# EAGLE design eTapper1main37 (EAGLE 8.4.0)
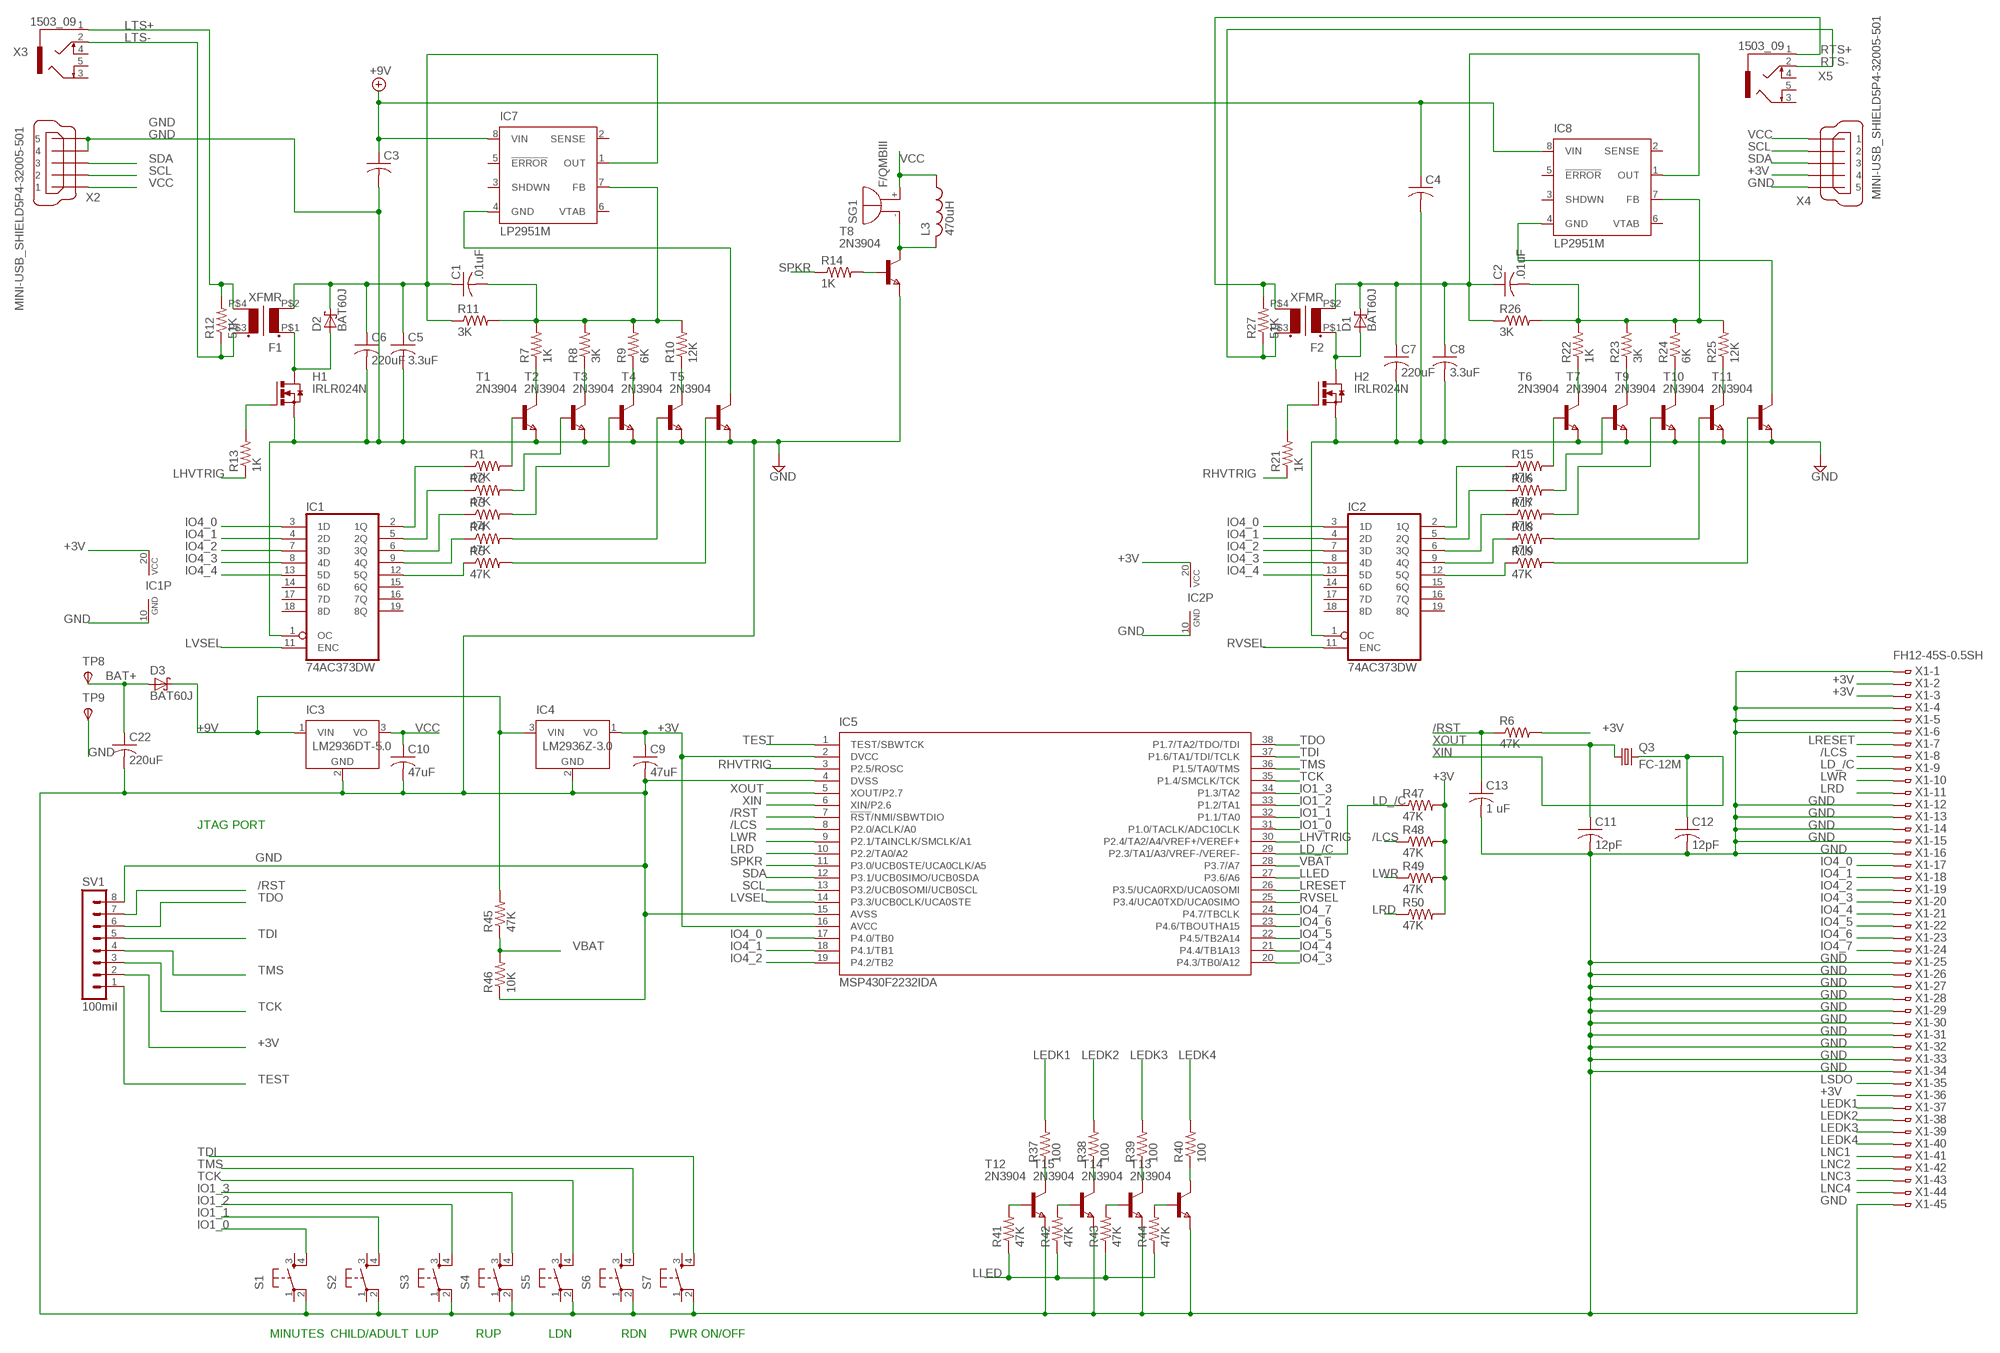
[diagram p0: schematic, sheet 1]

## Parts
C1  .01uF  C-USC0805  [C0805]
C2  .01uF  C-USC0805  [C0805]
C3  C-USC1206  [C1206]
C4  C-USC1206  [C1206]
C5  3.3uF  C-USC0805  [C0805]
C6  220uF  C-USC1206  [C1206]
C7  220uF  C-USC1206  [C1206]
C8  3.3uF  C-USC0805  [C0805]
C9  47uF  C-USC1206  [C1206]
C10  47uF  C-USC1206  [C1206]
C11  12pF  C-USC0805  [C0805]
C12  12pF  C-USC0805  [C0805]
C13  1 uF  C-USC0805  [C0805]
C22  220uF  C-USC1206  [C1206]
D1  BAT60J  [SOD323_ST]
D2  BAT60J  [SOD323_ST]
D3  BAT60J  [SOD323_ST]
F1  XFMR  [XFMR]
F2  XFMR  [XFMR]
H1  IRLR024N  [D-PAK_TO252AA]
H2  IRLR024N  [D-PAK_TO252AA]
IC1  74AC373DW  [SO20W]
IC2  74AC373DW  [SO20W]
IC3  LM2936DT-5.0  [TO252]
IC4  LM2936Z-3.0  [TO92]
IC5  MSP430F2232IDA  [TSSOP38_R-PDSO-G38-DA]
IC7  LP2951M  [SO08]
IC8  LP2951M  [SO08]
L3  470uH  L-USL2825P  [L2825P]
Q3  FC-12M  [FC-12M]
R1  47K  R-US_R0402  [R0402]
R2  47K  R-US_R0402  [R0402]
R3  47K  R-US_R0402  [R0402]
R4  47K  R-US_R0402  [R0402]
R5  47K  R-US_R0402  [R0402]
R6  47K  R-US_R0402  [R0402]
R7  1K  R-US_R0402  [R0402]
R8  3K  R-US_R0402  [R0402]
R9  6K  R-US_R0402  [R0402]
R10  12K  R-US_R0402  [R0402]
R11  3K  R-US_R0402  [R0402]
R12  51K  R-US_R0402  [R0402]
R13  1K  R-US_R0402  [R0402]
R14  1K  R-US_R0402  [R0402]
R15  47K  R-US_R0402  [R0402]
R16  47K  R-US_R0402  [R0402]
R17  47K  R-US_R0402  [R0402]
R18  47K  R-US_R0402  [R0402]
R19  47K  R-US_R0402  [R0402]
R21  1K  R-US_R0402  [R0402]
R22  1K  R-US_R0402  [R0402]
R23  3K  R-US_R0402  [R0402]
R24  6K  R-US_R0402  [R0402]
R25  12K  R-US_R0402  [R0402]
R26  3K  R-US_R0402  [R0402]
R27  51K  R-US_R0402  [R0402]
R37  100  R-US_R0402  [R0402]
R38  100  R-US_R0402  [R0402]
R39  100  R-US_R0402  [R0402]
R40  100  R-US_R0402  [R0402]
R41  47K  R-US_R0402  [R0402]
R42  47K  R-US_R0402  [R0402]
R43  47K  R-US_R0402  [R0402]
R44  47K  R-US_R0402  [R0402]
R45  47K  R-US_R0402  [R0402]
R46  10K  R-US_R0402  [R0402]
R47  47K  R-US_R0402  [R0402]
R48  47K  R-US_R0402  [R0402]
R49  47K  R-US_R0402  [R0402]
R50  47K  R-US_R0402  [R0402]
S1  10-XX  [B3F-10XX]
S2  10-XX  [B3F-10XX]
S3  10-XX  [B3F-10XX]
S4  10-XX  [B3F-10XX]
S5  10-XX  [B3F-10XX]
S6  10-XX  [B3F-10XX]
S7  10-XX  [B3F-10XX]
SG1  F/QMBIII  [F/QMBIII]
SV1  100mil  MA08-1  [MA08-1]
T1  2N3904  NPNSOT23  [SOT-23]
T2  2N3904  NPNSOT23  [SOT-23]
T3  2N3904  NPNSOT23  [SOT-23]
T4  2N3904  NPNSOT23  [SOT-23]
T5  2N3904  NPNSOT23  [SOT-23]
T6  2N3904  NPNSOT23  [SOT-23]
T7  2N3904  NPNSOT23  [SOT-23]
T8  2N3904  NPNSOT23  [SOT-23]
T9  2N3904  NPNSOT23  [SOT-23]
T10  2N3904  NPNSOT23  [SOT-23]
T11  2N3904  NPNSOT23  [SOT-23]
T12  2N3904  NPNSOT23  [SOT-23]
T13  2N3904  NPNSOT23  [SOT-23]
T14  2N3904  NPNSOT23  [SOT-23]
T15  2N3904  NPNSOT23  [SOT-23]
TP8  TPSTP06R  [TP06R]
TP9  TPSTP06R  [TP06R]
X1  FH12-45S-0.5SH  [FH12-45S-0.5SH]
X2  MINI-USB_SHIELD5P4-32005-501  [32005-501]
X3  1503_09  [1503_09]
X4  MINI-USB_SHIELD5P4-32005-501  [32005-501]
X5  1503_09  [1503_09]

## Nets
+3V [+3V]: C9.1 IC1.20(VCC) IC2.20(VCC) IC4.1(VO) IC5.2(DVCC) IC5.16(AVCC) R6.2 R47.2 R48.2 R49.2 R50.2 SV1.2 X1.2 X1.3 X1.36 X4.4
+9V [+9V]: C3.1 C4.1 D3.C IC3.1(VIN) IC4.3(VIN) IC7.8(VIN) IC8.8(VIN) R45.2
/LCS: IC5.8(P2.0/ACLK/A0) R48.1 X1.8
/RST: C13.1 IC5.7(!RST!/NMI/SBWTDIO) R6.1 SV1.7
BAT+ [BAT+]: C22.1 D3.A TP8.TP(PP)
GND [GND]: C3.2 C4.2 C5.2 C6.2 C7.2 C8.2 C9.2 C10.2 C11.2 C12.2 C13.2 C22.2 H1.3(S) H2.3(S) IC1.1(OC) IC1.10(GND) IC2.1(OC) IC2.10(GND) IC3.2(GND) IC4.2(GND) IC5.4(DVSS) IC5.15(AVSS) R46.1 S1.2(P1) S2.2(P1) S3.2(P1) S4.2(P1) S5.2(P1) S6.2(P1) S7.2(P1) SV1.8 T1.2(E) T2.2(E) T3.2(E) T4.2(E) T5.2(E) T6.2(E) T7.2(E) T8.2(E) T9.2(E) T10.2(E) T11.2(E) T12.2(E) T13.2(E) T14.2(E) T15.2(E) TP9.TP(PP) X1.1 X1.4 X1.5 X1.6 X1.12 X1.13 X1.14 X1.15 X1.16 X1.25 X1.26 X1.27 X1.28 X1.29 X1.30 X1.31 X1.32 X1.33 X1.34 X1.45 X2.4 X2.5 X4.5
IO1_0: IC5.31(P1.0/TACLK/ADC10CLK) S1.4(S1)
IO1_1: IC5.32(P1.1/TA0) S2.4(S1)
IO1_2: IC5.33(P1.2/TA1) S3.4(S1)
IO1_3: IC5.34(P1.3/TA2) S4.4(S1)
IO4_0: IC1.3(1D) IC2.3(1D) IC5.17(P4.0/TB0) X1.17
IO4_1: IC1.4(2D) IC2.4(2D) IC5.18(P4.1/TB1) X1.18
IO4_2: IC1.7(3D) IC2.7(3D) IC5.19(P4.2/TB2) X1.19
IO4_3: IC1.8(4D) IC2.8(4D) IC5.20(P4.3/TB0/A12) X1.20
IO4_4: IC1.13(5D) IC2.13(5D) IC5.21(P4.4/TB1A13) X1.21
IO4_5: IC5.22(P4.5/TB2A14) X1.22
IO4_6: IC5.23(P4.6/TBOUTHA15) X1.23
IO4_7: IC5.24(P4.7/TBCLK) X1.24
LD_/C: IC5.29(P2.3/TA1/A3/VREF-/VEREF-) R47.1 X1.9
LEDK1: R37.2 X1.37
LEDK2: R38.2 X1.38
LEDK3: R39.2 X1.39
LEDK4: R40.2 X1.40
LHVTRIG: IC5.30(P2.4/TA2/A4/VREF+/VEREF+) R13.1
LLED: IC5.27(P3.6/A6) R41.1 R42.1 R43.1 R44.1
LNC1: X1.41
LNC2: X1.42
LNC3: X1.43
LNC4: X1.44
LRD: IC5.10(P2.2/TA0/A2) R50.1 X1.11
LRESET: IC5.26(P3.5/UCA0RXD/UCA0SOMI) X1.7
LSDO: X1.35
LTS+: F1.P$4(S2) R12.2 X3.1
LTS-: F1.P$3(S1) R12.1 X3.2
LVSEL: IC1.11(ENC) IC5.14(P3.3/UCB0CLK/UCA0STE)
LWR: IC5.9(P2.1/TAINCLK/SMCLK/A1) R49.1 X1.10
N$1: IC1.2(1Q) R1.1
N$2: IC1.5(2Q) R2.1
N$3: IC1.6(3Q) R3.1
N$4: IC1.9(4Q) R4.1
N$5: IC1.12(5Q) R5.1
N$6: L3.2 SG1.-(+) T8.1(C)
N$7: R4.2 T4.3(B)
N$8: R5.2 T5.3(B)
N$9: D2.A F1.P$1(P1) H1.4(D)
N$10: R7.1 T1.1(C)
N$11: R8.1 T2.1(C)
N$12: R9.1 T3.1(C)
N$13: R1.2 T1.3(B)
N$14: R2.2 T2.3(B)
N$15: R3.2 T3.3(B)
N$16: R10.1 T4.1(C)
N$17: C1.2 IC7.7(FB) R7.2 R8.2 R9.2 R10.2 R11.2
N$18: C1.1 C5.1 C6.1 D2.C F1.P$2(P2) IC7.1(OUT) R11.1
N$19: D1.A F2.P$1(P1) H2.4(D)
N$20: IC2.2(1Q) R15.1
N$21: H1.1(G) R13.2
N$22: R14.2 T8.3(B)
N$24: IC2.5(2Q) R16.1
N$25: IC2.6(3Q) R17.1
N$26: IC2.9(4Q) R18.1
N$27: IC2.12(5Q) R19.1
N$28: R44.2 T13.3(B)
N$29: R15.2 T6.3(B)
N$30: R16.2 T7.3(B)
N$31: R17.2 T9.3(B)
N$32: R18.2 T10.3(B)
N$33: R19.2 T11.3(B)
N$35: R22.1 T6.1(C)
N$36: R23.1 T7.1(C)
N$37: R24.1 T9.1(C)
N$38: R25.1 T10.1(C)
N$39: C2.2 IC8.7(FB) R22.2 R23.2 R24.2 R25.2 R26.2
N$40: C2.1 C7.1 C8.1 D1.C F2.P$2(P2) IC8.1(OUT) R26.1
N$41: R37.1 T12.1(C)
N$42: H2.1(G) R21.2
N$43: R38.1 T15.1(C)
N$44: R39.1 T14.1(C)
N$45: IC7.4(GND) T5.1(C)
N$46: R40.1 T13.1(C)
N$47: IC8.4(GND) T11.1(C)
N$48: R43.2 T14.3(B)
N$49: R41.2 T12.3(B)
N$50: R42.2 T15.3(B)
RHVTRIG: IC5.3(P2.5/ROSC) R21.1
RTS+: F2.P$4(S2) R27.2 X5.1
RTS-: F2.P$3(S1) R27.1 X5.2
RVSEL: IC2.11(ENC) IC5.25(P3.4/UCA0TXD/UCA0SIMO)
SCL: IC5.13(P3.2/UCB0SOMI/UCB0SCL) X2.2 X4.2
SDA: IC5.12(P3.1/UCB0SIMO/UCB0SDA) X2.3 X4.3
SPKR: IC5.11(P3.0/UCB0STE/UCA0CLK/A5) R14.1
TCK: IC5.35(P1.4/SMCLK/TCK) S5.4(S1) SV1.3
TDI: IC5.37(P1.6/TA1/TDI/TCLK) S7.4(S1) SV1.5
TDO: IC5.38(P1.7/TA2/TDO/TDI) SV1.6
TEST: IC5.1(TEST/SBWTCK) SV1.1
TMS: IC5.36(P1.5/TA0/TMS) S6.4(S1) SV1.4
VBAT: IC5.28(P3.7/A7) R45.1 R46.2
VCC [VCC]: C10.1 IC3.3(VO) L3.1 SG1.+(-) X2.1 X4.1
XIN: C12.1 IC5.6(XIN/P2.6) Q3.2
XOUT: C11.1 IC5.5(XOUT/P2.7) Q3.1
Unconnected: IC1.14(6D) IC1.15(6Q) IC1.16(7Q) IC1.17(7D) IC1.18(8D) IC1.19(8Q) IC2.14(6D) IC2.15(6Q) IC2.16(7Q) IC2.17(7D) IC2.18(8D) IC2.19(8Q) IC7.2(SENSE) IC7.3(SHDWN) IC7.5(!ERROR) IC7.6(VTAB) IC8.2(SENSE) IC8.3(SHDWN) IC8.5(!ERROR) IC8.6(VTAB) S1.1(P) S1.3(S) S2.1(P) S2.3(S) S3.1(P) S3.3(S) S4.1(P) S4.3(S) S5.1(P) S5.3(S) S6.1(P) S6.3(S) S7.1(P) S7.3(S) X2.M1(S1) X2.M2(S2) X2.M3(S3) X2.M4(S4) X3.3 X3.4 X3.5 X4.M1(S1) X4.M2(S2) X4.M3(S3) X4.M4(S4) X5.3 X5.4 X5.5

## Notes on the sheet
- JTAG PORT
- MINUTES | CHILD/ADULT | LUP | RUP | LDN | RDN | PWR ON/OFF

## Library data of the parts
C1-C13 C22 = rcl:C-US: CAPACITOR, American symbol
D1-D3 = diode:BAT60J: Schottky barrier diode Source: www.st.com, BAT60J.pdf
F1 F2 = XFMR1:XFMR: Transformer 1"X1" 0.4"X0.4" hole separation for e_tapper
H1 H2 = IRLR024N:IRLR024N: IRLR024N HEXFET Power Mosfet N channel Infeneon Technology TO-251AA IPAK
IC1 IC2 = 74xx-eu:74*373: Octal D type transparent LATCH, edge triggered
IC3 = national-semiconductor:LM2936?*: Ultra-Low Quiescent Current LDO Voltage Regulator Source: Data sheet <http://www.national.com/ds/LM/LM2936.pdf>; MF: NATIONAL SEMICONDUCTOR; MPN: LM2936DT-5.0/NOPB; OC_FARNELL: 1286864; OC_NEWARK: 41K4501
IC4 = national-semiconductor:LM2936?*: Ultra-Low Quiescent Current LDO Voltage Regulator Source: Data sheet <http://www.national.com/ds/LM/LM2936.pdf>; MF: NATIONAL SEMICONDUCTOR; MPN: LM2936Z-3.0/NOPB; OC_FARNELL: 1312709; OC_NEWARK: 41K4531
IC5 = texas:MSP430F22*2IDA: MIXED SIGNAL MICROCONTROLLER Source: http://focus.ti.com/lit/ds/symlink/msp430f2274.pdf; MPN: MSP430F2232IDA; OC_FARNELL: 1610178; OC_NEWARK: 28M6312
IC7 IC8 = national-semiconductor:LP2951: Adjustable Micropower Voltage Regulator Source: http://www.national.com/ds/LP/LP2950.pdf; MF: FAIRCHILD SEMICONDUCTOR; MPN: LP2951CM; OC_FARNELL: 9488561; OC_NEWARK: 78K6014
L3 = rcl:L-US: INDUCTOR, American symbol
Q3 = crystal:FC-12M: kHz RANGE CRYSTAL UNIT LOW PROFILE SMD Source: Epson Toyocom FC-12M.pdf
R1-R19 R21-R27 R37-R50 = resistor:R-US_: RESISTOR, American symbol
S1-S7 = switch-omron:10-XX: OMRON SWITCH; MPN: B3F-1000; OC_FARNELL: 176432; OC_NEWARK: 36M3542
SG1 = buzzer:F/QMBIII: BUZZER Source: Buerklin; OC_FARNELL: unknown; OC_NEWARK: unknown
SV1 = con-lstb:MA08-1: PIN HEADER; OC_FARNELL: unknown; OC_NEWARK: unknown
T1-T15 = zetex:NPNSOT23: NPN TRANSISTOR; MPN: DSS20201L-7; OC_FARNELL: 1710688; OC_NEWARK: 25R4555
TP8 TP9 = testpad:TPS: TEST PIN
X1 = con-hirose:FH12-45S-0.5S: 0.5mm Pitch Connectors For FPC/FFC Source: Data sheet <http://www.hirose.co.jp/cataloge_hp/e58605370.pdf>; OC_FARNELL: unknown; OC_NEWARK: unknown
X2 X4 = con-cypressindustries:MINI-USB_SHIELD5P4-: MINI USB-B R/A W/O POST 5 pol. Source: www.cypressindustries.com; OC_FARNELL: unknown; OC_NEWARK: unknown
X3 X5 = con-lumberg:1503_09: Jack connectors according to JISC 6560, 3.5 mm Klinkeneinbaukupplung nach JISC 6560, 3,5 mm, 3-polig/ stereo, abgewinkelte Ausführung, mit 2 Öffnern und Lötaugen, für Leiterplatten Rückseitenmontage Source: http://www.lumberg.com/Produkte/PDFs/1503_09.pdf; OC_FARNELL: 1243244; OC_NEWARK: unknown

## Module LP2951
Ports: 

### Library data of the parts

## Net classes
1 GND: width 0.305 mm, clearance 0.152 mm
2 BAT+: width 0.305 mm, clearance 0.152 mm
3 +9V: width 0.305 mm, clearance 0.152 mm
4 +3V: width 0.305 mm, clearance 0.152 mm
5 VCC: width 0.305 mm, clearance 0.152 mm

## Board
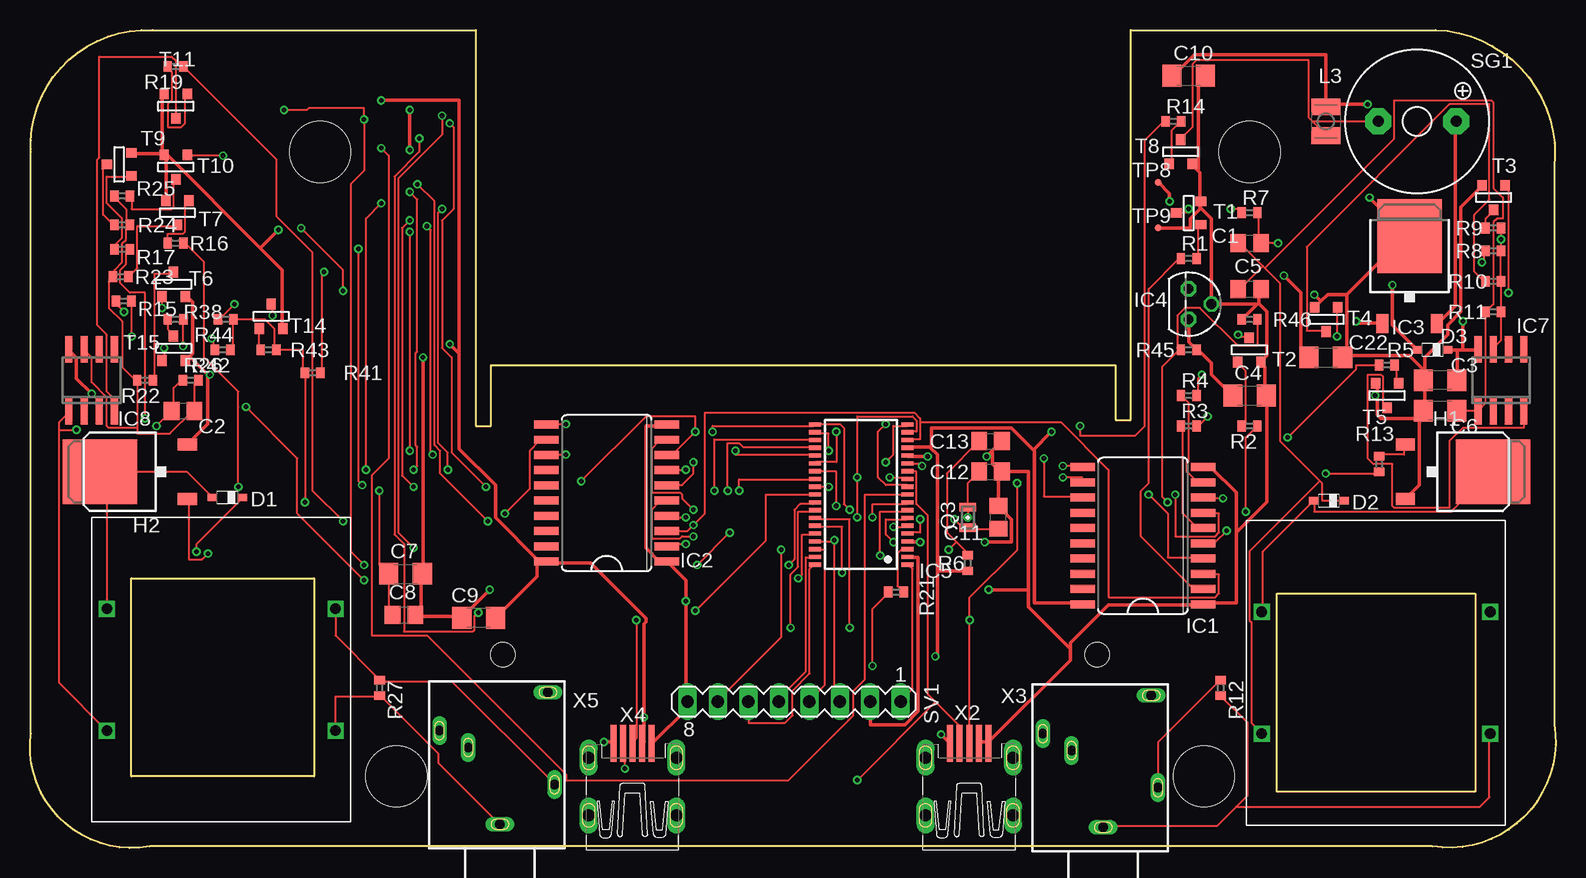
[diagram p1: board, top side]
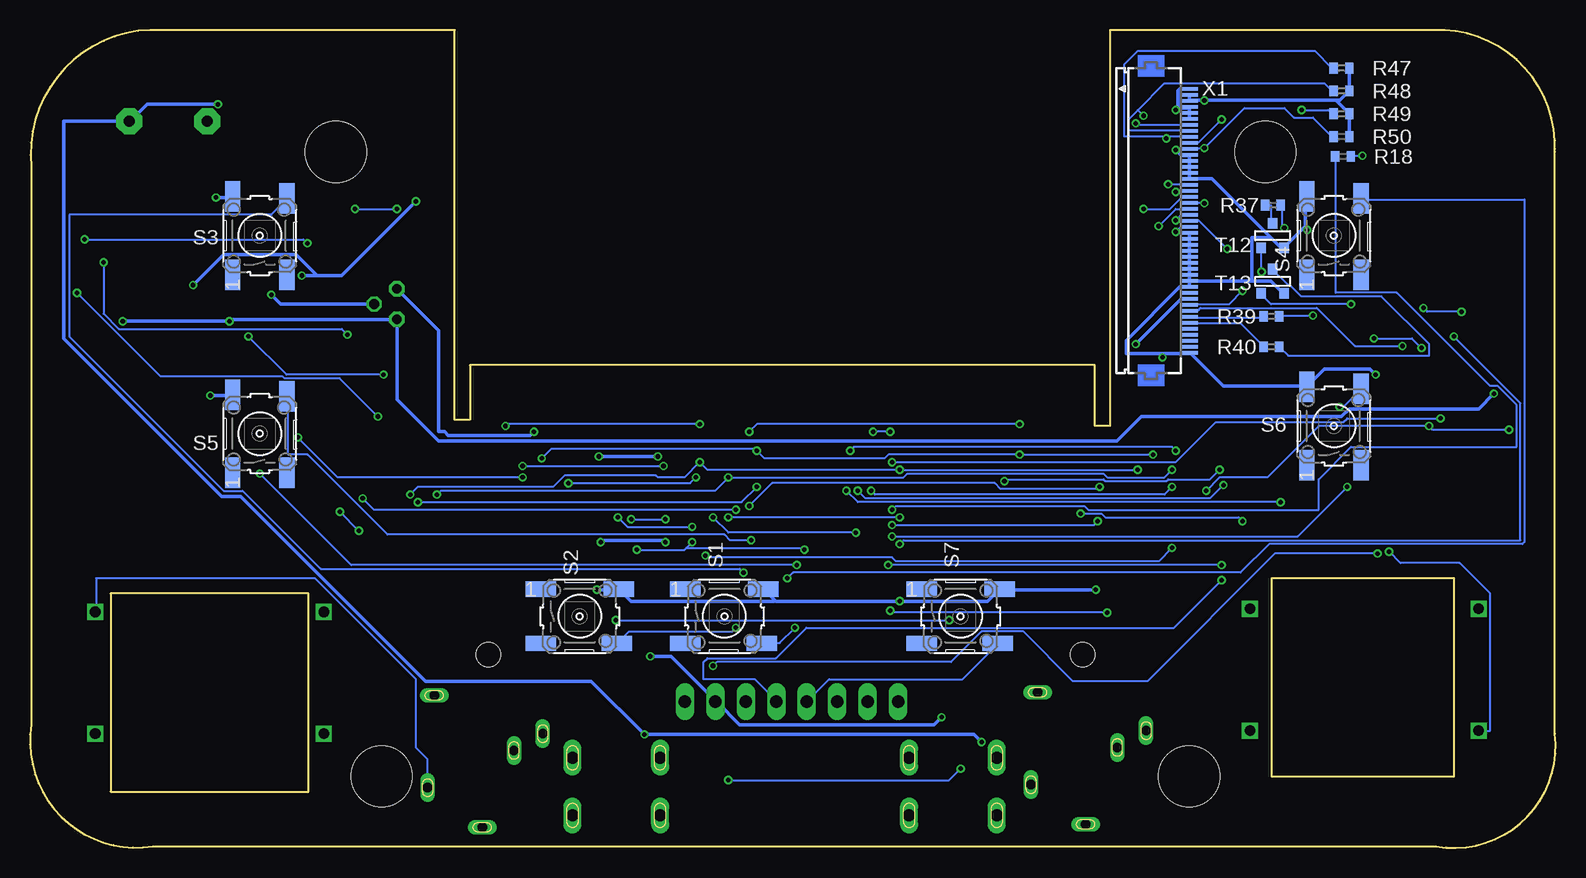
[diagram p2: board, bottom side, seen from below]

Size 127.17 x 68.21 mm. Coordinates in mm from the lower left corner, seen from the top.
Outline: 0.06,58.04 0.06,58.3 0.06,9.53
Outline: 0.06,58.04 0.06,9.53
Outline: 0.06,58.04 arc-96 10.22,68.2 37.15,68.2 37.15,35.18 38.42,35.18 38.42,40.26 90.49,40.26 90.49,35.69 91.76,35.69 91.76,68.2 117.16,68.2 arc-94 127.06,56.77 127.06,10.29 arc-108 116.9,0.13 9.97,0.13 arc-107 0.06,9.53
Outline: 103.95,21.21 120.46,21.21 120.46,4.7 103.95,4.7 103.95,21.21
Outline: 8.45,22.48 23.69,22.48 23.69,5.97 8.45,5.97 8.45,22.48
Copper layers (1*16): Top 0.035mm / dielectric 1.5mm / Bottom 0.035mm
Design rules "default *": minimum track width 6mil, minimum drill 15mil, track to track 6mil, track to pad 6mil, pad to pad 6mil, via to via 6mil, smd to smd 6mil, copper to edge 40mil, drill to drill 6mil, minimum pad ring 6mil, minimum via ring 6mil, stop-mask expansion 4mil, vias tented up to drill 0mil, thermal gap 10mil
Holes 5.08 mm at 24.19,58.04 101.66,58.04 30.54,5.97 97.85,5.97
Holes 2.03 mm at 39.43,16.13 88.96,16.13

### Footprints (pad centres in the part's own frame; a part is rotated, then mirrored left to right if it is on the bottom)
C0805 = smd 1.3 x 1.5: 1 -0.95,0; 2 0.95,0
C1206 = smd 1.6 x 1.8: 1 -1.4,0; 2 1.4,0
SOD323_ST = smd 0.8 x 0.6: A 1.25,0; C -1.25,0
XFMR = drill 0.889 square: P$1 -10.16,5.08; P$2 -10.16,-5.08; P$3 8.89,5.08; P$4 8.89,-5.08
D-PAK_TO252AA = smd 1 x 1.6: 1 -2.28,-4.8; 3 2.28,-4.8 | smd 5.4 x 6.2: 4 0,2.5
SO20W = smd 0.66 x 2.032: 1 -5.715,-5.029; 2 -4.445,-5.029; 3 -3.175,-5.029; 4 -1.905,-5.029; 5 -0.635,-5.029; 6 0.635,-5.029; 7 1.905,-5.029; 8 3.175,-5.029; 9 4.445,-5.029; 10 5.715,-5.029; 11 5.715,5.029; 12 4.445,5.029; 13 3.175,5.029; 14 1.905,5.029; 15 0.635,5.029; 16 -0.635,5.029; 17 -1.905,5.029; 18 -3.175,5.029; 19 -4.445,5.029; 20 -5.715,5.029
TO252 = smd 1 x 1.6: 1 -2.28,-4.8; 3 2.28,-4.8 | smd 5.4 x 6.2: 2 0,2.5
TO92 = drill 0.813 pad 1.27 octagon: 1 -1.27,0; 2 0,1.905; 3 1.27,0
TSSOP38_R-PDSO-G38-DA = smd 0.35 x 1: 1 -5.85,-3.85; 2 -5.2,-3.85; 3 -4.55,-3.85; 4 -3.9,-3.85; 5 -3.25,-3.85; 6 -2.6,-3.85; 7 -1.95,-3.85; 8 -1.3,-3.85; 9 -0.65,-3.85; 10 0,-3.85; 11 0.65,-3.85; 12 1.3,-3.85; 13 1.95,-3.85; 14 2.6,-3.85; 15 3.25,-3.85; 16 3.9,-3.85; 17 4.55,-3.85; 18 5.2,-3.85; 19 5.85,-3.85; 20 5.85,3.85; 21 5.2,3.85; 22 4.55,3.85; 23 3.9,3.85; 24 3.25,3.85; 25 2.6,3.85; 26 1.95,3.85; 27 1.3,3.85; 28 0.65,3.85; 29 0,3.85; 30 -0.65,3.85; 31 -1.3,3.85; 32 -1.95,3.85; 33 -2.6,3.85; 34 -3.25,3.85; 35 -3.9,3.85; 36 -4.55,3.85; 37 -5.2,3.85; 38 -5.85,3.85
SO08 = smd 0.6 x 2.2: 1 -1.905,-2.6; 2 -0.635,-2.6; 3 0.635,-2.6; 4 1.905,-2.6; 5 1.905,2.6; 6 0.635,2.6; 7 -0.635,2.6; 8 -1.905,2.6
L2825P = smd 1.4 x 2.4: 1 -1.2,0; 2 1.2,0
FC-12M = smd 0.7 x 1.4: 1 -0.85,0; 2 0.85,0
R0402 = smd 0.7 x 0.9: 1 -0.65,0; 2 0.65,0
B3F-10XX = smd 2.54 x 1.27: 1 -3.251,2.261; 2 3.251,2.261; 3 -3.251,-2.261; 4 3.099,-2.261
F/QMBIII = drill 0.914 pad 2.159 octagon: + 3.251,0; - -3.251,0
MA08-1 = drill 1.016 long: 1 -8.89,0; 2 -6.35,0; 3 -3.81,0; 4 -1.27,0; 5 1.27,0; 6 3.81,0; 7 6.35,0; 8 8.89,0
SOT-23 = smd 0.787 x 0.889: 1 0.025,-1.016; 2 -0.94,1.016; 3 0.991,1.016
TP06R = smd 0.6 x 0.6: TP 0,0
FH12-45S-0.5SH = smd 0.3 x 1.3: 1 -13,3.25; 2 -12.5,3.25; 3 -12,3.25; 4 -11.5,3.25; 5 -11,3.25; 6 -10.5,3.25; 7 -10,3.25; 8 -9.5,3.25; 9 -9,3.25; 10 -8.5,3.25; 11 -8,3.25; 12 -7.5,3.25; 13 -7,3.25; 14 -6.5,3.25; 15 -6,3.25; 16 -5.5,3.25; 17 -5,3.25; 18 -4.5,3.25; 19 -4,3.25; 20 -3.5,3.25; 21 -3,3.25; 22 -2.5,3.25; 23 -2,3.25; 24 -1.5,3.25; 25 -1,3.25; 26 -0.5,3.25; 27 0,3.25; 28 0.5,3.25; 29 1,3.25; 30 1.5,3.25; 31 2,3.25; 32 2.5,3.25; 33 3,3.25; 34 3.5,3.25; 35 4,3.25; 36 4.5,3.25; 37 5,3.25; 38 5.5,3.25; 39 6,3.25; 40 6.5,3.25; 41 7,3.25; 42 7.5,3.25; 43 8,3.25; 44 8.5,3.25; 45 9,3.25
32005-501 = smd 3.1 x 0.5: 1 3,1.6; 2 3,0.8; 3 3,0; 4 3,-0.8; 5 3,-1.6 | drill 1 pad 1.422 long: M1 -3,3.65; M2 -3,-3.65; M3 1.8,3.65; M4 1.8,-3.65
1503_09 = drill 0.8 pad 1.2 long: 1 0,-2.1; 2 -4.55,-5.4; 3 5.05,-9.9; 4 -4,-13.1; 5 2.65,-8.5

### Placement (x,y rotation side)
C1  101.66,50.42 0 top
C2  12.76,36.45 0 top
C3  117.54,38.99 180 top
C4  101.66,37.72 0 top
C5  101.66,46.61 0 top
C6  117.54,36.45 180 top
C7  31.31,22.87 0 top
C8  31.18,19.44 0 top
C9  37.4,19.18 180 top
C10  96.58,64.39 0 top
C11  80.71,27.56 90 top
C12  80.07,31.37 0 top
C13  80.07,33.91 0 top
C22  108.01,40.9 0 top
D1  16.45,29.22 180 top
D2  108.27,28.96 180 top
D3  116.9,41.53 180 top
F1  112.84,14.61 0 top
F2  16.57,14.86 0 top
H1  119.44,31.37 270 top
H2  8.32,31.37 90 top
IC1  92.77,26.04 90 top
IC2  48.07,29.6 90 top
IC3  115,48.52 0 top
IC4  96.58,45.34 270 top
IC5  69.28,29.47 90 top
IC7  122.62,38.99 0 top
IC8  5.14,38.99 0 top
L3  108.01,60.58 270 top
Q3  78.17,27.56 90 top
R1  96.58,49.15 0 top
R2  101.66,35.18 180 top
R3  96.58,35.18 0 top
R4  96.58,37.72 0 top
R5  113.09,40.26 0 top
R6  78.17,23.75 270 top
R7  101.66,52.96 0 top
R8  121.98,49.79 0 top
R9  121.98,51.69 0 top
R10  121.98,47.25 0 top
R11  121.98,44.71 0 top
R12  99.25,13.34 270 top
R13  112.46,32.01 90 top
R14  95.31,60.58 0 top
R15  7.81,45.6 180 top
R16  12.13,50.42 180 top
R17  7.68,49.92 180 top
R18  17.72,57.66 0 bottom
R19  12.13,65.16 180 top
R21  72.2,21.34 180 top
R22  9.59,38.99 180 top
R23  7.56,47.63 180 top
R24  7.68,51.95 0 top
R25  7.68,54.36 180 top
R26  13.4,38.99 0 top
R27  29.15,13.34 270 top
R37  23.56,53.6 0 bottom
R38  12.13,44.07 0 top
R39  23.69,44.33 180 bottom
R40  23.69,41.79 180 bottom
R41  23.56,39.63 0 top
R42  16.07,41.53 180 top
R43  19.88,41.53 180 top
R44  16.32,44.07 180 top
R45  96.58,41.53 0 top
R46  101.66,44.07 0 top
R47  17.84,65.03 0 bottom
R48  17.84,63.12 0 bottom
R49  17.84,61.22 0 bottom
R50  17.84,59.31 0 bottom
S1  69.28,19.31 0 bottom
S2  81.34,19.31 0 bottom
S3  108.01,51.06 90 bottom
S4  18.48,51.06 90 bottom
S5  108.01,34.55 90 bottom
S6  18.48,35.18 90 bottom
S7  49.59,19.31 0 bottom
SG1  115.63,60.58 0 top
SV1  63.69,12.2 180 top
T1  96.58,52.96 270 top
T2  101.66,41.53 180 top
T3  121.98,54.23 0 top
T4  108.01,44.07 0 top
T5  113.09,37.72 0 top
T6  12,47 180 top
T7  12.26,52.96 0 top
T8  95.95,58.04 180 top
T9  7.43,57.03 270 top
T10  12.13,56.77 0 top
T11  12.13,61.85 0 top
T12  23.56,51.06 180 bottom
T13  23.56,47.25 180 bottom
T14  20.13,44.33 180 top
T15  12,41.66 180 top
TP8  94.04,55.5 0 top
TP9  94.04,51.69 0 top
X1  33.72,50.3 270 bottom
X2  78.3,5.72 90 top
X3  89.47,-0.38 180 top
X4  50.23,5.72 90 top
X5  39.18,-0.12 180 top

### Tracks (layer width: path | path; a pad name or v marks a point on that pad's centre or on a via)
+3V  (via drill 0.38)
  Top 0.305: IC5.2 73.25,24.23 74.04,24.23 74.04,11.37 72.93,10.26 70.07,10.26 70.07,12.17 SV1.2 | 75.63,23.12 78.17,23.12 R6.2 | 75.63,23.12 75.63,32.8 75.07,33.36 | 75.07,33.36 74.99,33.44 73.25,33.44 IC5.16 | 83.65,33.2 81.82,35.03 75.15,35.03 75.15,33.44 75.07,33.36 | 83.65,33.2 83.72,33.12 83.72,20.42 87.69,20.42 IC1.20 | 83.65,33.2 v85.15,34.71 | v75.47,15.98 75.63,16.13 75.63,23.12 | 35.7,41.3 35.78,41.22 35.78,33.28 38.8,30.26 38.8,27.56 42.45,23.91 42.93,23.91 IC2.20 | 35.7,41.3 v34.99,42.01 | C9.1 38.96,19.31 42.29,22.64 42.29,23.91 IC2.20 | X4.4 51.18,8.83 v51.18,10.9 51.18,18.67 51.34,18.83 51.34,19.15 46.74,23.75 43.08,23.75 IC2.20 | v29.27,62.33 35.78,62.33 35.78,41.38 35.7,41.3
  Bottom 0.305: IC4.1 93.09,43.12 93.09,34.71 92.61,34.71 92.3,34.39 85.47,34.39 v85.15,34.71 | v75.47,15.98 73.72,15.98 70.07,12.32 SV1.2 69.91,12.17 68.01,10.26 51.82,10.26 v51.18,10.9 | 17.21,61.22 17.21,59.31 R50.2 | X1.2 30.54,62.65 30.54,62.33 X1.3 30.38,62.33 v29.27,62.33 18.32,62.33 | 17.21,63.12 17.21,65.03 R47.2 | 18.32,62.33 18,62.33 17.21,63.12 | 17.21,63.12 R48.2 | 18.32,62.33 17.21,61.22 | 17.21,61.22 R49.2 | v34.99,42.01 31.18,45.82 30.54,45.82 X1.36
+9V  (via drill 0.38)
  Top 0.305: 119.44,41.53 120.71,41.53 IC7.8 | 119.44,41.53 118.97,41.53 | 118.97,41.53 D3.C | 118.97,41.53 118.97,38.99 C3.1 | IC4.3 96.58,42.17 97.22,41.53 R45.2 97.38,41.53 98.49,40.42 98.49,39.47 100.23,37.72 C4.1 | v110.55,43.92 110.55,43.76 112.62,43.76 IC3.1 | v5.14,37.88 3.87,39.15 3.87,40.9 3.24,41.53 IC8.8 | v119.44,43.92 119.44,41.53
  Bottom 0.305: v5.14,37.88 6.41,36.61 17.21,36.61 17.84,35.98 34.51,35.98 36.58,33.91 93.09,33.91 96.58,37.41 IC4.3 110.39,44.07 v110.55,43.92 v119.44,43.92
/LCS  (via drill 0.38)
  Top 0.152: v70.87,24.39 70.87,28.04 73.09,28.04 IC5.8 | v31.97,25.02 30.7,26.29 30.7,55.82 34.35,59.47 v34.35,61.06
  Bottom 0.152: 34.83,61.54 35.62,60.74 35.62,59.79 30.54,59.79 X1.8 | 34.83,61.54 32.61,63.76 19.27,63.76 18.64,63.12 R48.1 | v70.87,24.39 70.71,24.23 55.31,24.23 54.99,23.91 33.08,23.91 v31.97,25.02 | 34.83,61.54 v34.35,61.06
/RST  (via drill 0.38)
  Top 0.152: 77.22,25.5 76.42,26.29 76.42,31.22 C13.1 | 77.22,25.5 78.17,24.55 R6.1 | v71.98,25.5 71.34,26.14 71.34,27.41 73.09,27.41 IC5.7 | 77.22,25.5 v76.58,24.87 | v62.61,24.87 62.61,17.56 57.37,12.32 SV1.7
  Bottom 0.152: 72.45,25.02 72.61,24.87 v76.58,24.87 | 72.45,25.02 v71.98,25.5 | v62.61,24.87 62.77,25.02 72.45,25.02
BAT+  (via drill 0.38)
  Top 0.305: TP8.TP 95,54.55 v95,53.92 | v104.52,47.73 105.95,46.3 105.95,41.53 106.58,40.9 C22.1 | v113.57,46.93 113.57,43.6 115.63,41.53 D3.A
  Bottom 0.305: v95,53.92 101.19,47.73 103.25,47.73 | v104.52,47.73 103.25,47.73 | v113.57,46.93 111.03,49.47 105,49.47 103.25,47.73
GND  (via drill 0.38)
  Top 0.305: 107.62,45.58 108.17,46.14 109.76,46.14 | 107.62,45.58 107.22,45.19 T4.2 | 109.76,46.14 109.76,41.22 109.44,40.9 C22.2 109.76,41.06 115,41.06 116.27,39.79 | v111.66,54.23 115,50.9 IC3.2 114.68,51.06 109.76,46.14 | 112.3,37.72 112.3,36.14 112.62,35.82 115.79,35.82 | 112.3,37.72 112.3,38.68 T5.2 | 115.79,35.82 116.11,35.82 116.11,36.45 C6.2 | 115.79,35.82 115.79,30.26 114.68,29.15 H1.3 | 115.79,35.82 C6.2 | 112.3,37.72 v112.14,37.72 | 116.27,38.99 116.27,39.79 | 116.27,39.79 116.27,40.9 118.17,42.8 118.17,43.6 119.28,44.71 119.28,53.44 121.03,55.19 T3.2 | 116.27,38.99 116.27,36.45 C6.2 | 116.27,38.99 C3.2 116.27,39.79 | 102.38,45.42 102.46,45.5 102.46,46.61 C5.2 | 102.38,45.42 102.22,45.27 | 102.22,45.27 101.03,44.07 R46.1 | 102.38,45.42 103.09,44.71 103.09,41.06 102.62,40.58 T2.2 102.62,40.42 102.93,40.11 102.93,37.72 C4.2 103.09,37.72 103.09,28.83 100.55,26.29 | 102.22,45.27 102.14,45.34 IC4.2 98.49,52.49 97.54,53.44 | TP9.TP 96.74,51.69 96.74,52.49 97.54,53.28 97.54,53.44 | 97.54,53.44 97.54,53.76 T1.2 97.54,53.92 97.54,56.3 97.3,56.54 | 97.3,56.54 96.9,56.93 T8.2 | C10.2 97.85,64.39 97.38,63.92 97.38,56.62 97.3,56.54 | v74.2,25.5 73.25,25.5 IC5.4 | v79.6,25.5 81.82,25.5 81.82,27.41 C11.2 | v74.83,32.64 73.25,32.64 IC5.15 | 80.15,33.04 80.87,33.76 80.87,33.91 C13.2 | 80.15,33.04 v79.76,32.64 | C12.2 80.87,31.37 80.23,32.01 80.23,32.96 80.15,33.04 | C11.2 80.71,31.37 C12.2 | C11.2 | X2.4 79.12,8.83 79.76,8.83 X2.5 79.91,8.83 86.74,15.66 86.74,16.61 | 100.55,26.29 100.55,29.63 98.49,31.69 97.85,31.69 IC1.10 | 100.55,26.29 100.55,20.42 97.85,20.42 IC1.1 97.69,20.26 89.92,20.26 86.74,17.09 86.74,16.61
  Top 0.305: C12.2 83.25,31.37 83.25,21.53 | 83.25,21.53 83.25,20.1 86.74,16.61 | v107.06,46.14 107.62,45.58 | 19.19,50.03 11.33,57.89 T10.2 | 19.19,50.03 21.02,48.2 21.02,43.44 T14.2 | T7.2 11.33,54.08 11.33,57.73 T10.2 | 11.02,57.89 11.18,57.89 T10.2 | 11.02,57.89 8.48,57.89 T9.2 | 11.02,57.89 11.02,62.65 11.18,62.81 T11.2 | 11.02,57.89 T10.2 | v31.65,58.2 v31.65,61.54 | 13.32,40.98 13.56,41.22 13.56,45.5 13.08,45.98 T6.2 | 13.32,40.98 13.08,40.74 T15.2 | 14.83,39.47 14.83,35.34 13.24,33.76 H2.3 | 13.32,40.98 14.83,39.47 | v14.99,39.47 14.83,39.47 | v20.7,51.54 19.19,50.03 | IC2.10 53.09,35.18 51.34,35.18 51.34,25.02 52.45,23.91 53.09,23.91 IC2.1 53.24,23.75 54.67,22.33 v54.67,20.58 54.67,12.32 SV1.8 54.67,12.17 54.67,11.53 51.97,8.83 X4.5 | v38.32,21.53 36.1,19.31 C9.2 35.94,19.31 32.13,19.31 C8.2 32.13,19.47 32.61,19.94 32.61,22.8 C7.2 32.77,22.96 v32.77,40.9 | v79.91,21.53 83.25,21.53
  Bottom 0.305: v111.66,54.23 110.39,54.23 S3.2 | v112.14,37.72 110.39,37.72 S5.2 | v74.2,25.5 74.36,25.66 79.44,25.66 v79.6,25.5 | v79.76,32.64 v74.83,32.64 | v107.06,46.14 106.27,45.34 IC4.2 | 30.54,49.79 30.54,50.27 X1.27 30.54,50.42 30.54,50.74 X1.26 30.54,50.9 30.54,51.22 X1.25 | 25.3,47.25 30.38,47.25 X1.33 | 25.3,47.25 23.72,47.25 22.76,46.3 T13.2 | X1.33 30.54,47.25 30.54,46.93 X1.34 30.54,46.77 31.34,46.77 35.78,42.33 35.78,41.22 32.77,41.22 | X1.33 30.54,47.41 30.54,47.73 X1.32 30.54,47.88 30.54,48.2 X1.31 30.54,48.36 30.54,48.68 X1.30 30.54,48.84 30.54,49.15 X1.29 30.54,49.31 30.54,49.79 | 30.54,49.79 X1.28 | X1.6 30.54,60.9 30.54,61.22 X1.5 30.54,61.38 30.54,61.7 | 31.5,61.7 31.5,63.12 31.34,63.28 30.54,63.28 X1.1 | 30.54,61.7 31.5,61.7 | 30.54,61.7 X1.4 | 30.54,56.3 30.54,55.82 X1.16 30.38,55.82 28.64,55.82 23.8,50.98 | 30.54,57.73 30.54,57.41 X1.13 30.54,57.25 30.54,56.93 X1.14 30.54,56.77 30.54,56.3 | 30.54,56.3 X1.15 | 20.94,51.77 20.86,51.85 20.86,54.23 S4.2 | 20.94,51.77 22.61,50.11 T12.2 22.76,50.11 22.92,50.11 23.8,50.98 | v31.65,61.54 31.5,61.7 | v31.65,58.2 31.18,57.73 30.54,57.73 | 30.54,57.73 X1.12 | 25.3,47.25 25.3,50.9 23.88,50.9 23.8,50.98 | v14.99,39.47 15.46,39.95 19.27,39.95 20.7,38.52 S6.2 20.86,38.52 27.69,38.52 30.38,41.22 X1.45 30.54,41.22 32.77,41.22 | 20.94,51.77 v20.7,51.54 | 65.07,20.66 65.94,21.53 S1.2 | 65.07,20.66 64.99,20.58 v54.67,20.58 47.37,20.58 46.42,21.53 S7.2 46.26,21.53 v38.32,21.53 | 65.07,20.66 65.15,20.58 77.06,20.58 78.01,21.53 S2.2 78.17,21.53 v79.91,21.53 | v32.77,40.9 32.77,41.22
IO1_0  (via drill 0.38)
  Top 0.152: v63.4,18.36 63.4,22.8 64.04,23.44 64.04,28.04 65.31,28.04 IC5.31
  Bottom 0.152: v63.4,18.36 64.67,17.09 66.1,17.09 S1.4
IO1_1  (via drill 0.38)
  Top 0.152: v68.33,18.36 68.33,27.41 65.47,27.41 IC5.32
  Bottom 0.152: v68.33,18.36 68.64,18.04 77.22,18.04 78.17,17.09 S2.4
IO1_2  (via drill 0.38)
  Top 0.152: v67.69,22.96 67.69,26.77 65.47,26.77 IC5.33
  Bottom 0.152: v67.69,22.96 68.01,23.28 102.93,23.28 109.44,29.79 111.03,29.79 123.89,42.65 123.89,52.81 107.06,52.81 105.79,54.08 S3.4
IO1_3  (via drill 0.38)
  Top 0.152: v64.04,22.48 64.36,22.8 64.36,26.14 65.31,26.14 IC5.34
  Bottom 0.152: v64.04,22.48 63.56,22.96 26.26,22.96 23.88,25.34 2.76,25.34 2.6,25.5 2.6,54.08 16.1,54.08 S4.4
IO4_0  (via drill 0.38)
  Top 0.152: 74.2,35.5 74.2,35.82 73.72,36.3 56.26,36.3 56.26,27.88 v55.31,26.93 54.83,26.45 53.24,26.45 IC2.3 | 74.2,35.5 74.2,34.07 73.25,34.07 IC5.17 | v32.29,55.35 33.72,53.92 33.72,33.6 34.19,33.12 34.19,31.22 v38.16,27.25 | 74.2,35.5 85.95,35.5 89.92,31.53 89.92,20.9 98.81,20.9 99.12,21.21 99.12,22.8 97.85,22.8 IC1.3
  Bottom 0.152: v32.29,55.35 30.54,55.35 X1.17 | v38.16,27.25 38.48,26.93 v55.31,26.93
IO4_1  (via drill 0.38)
  Top 0.152: v68.96,27.56 v68.96,30.9 68.96,35.98 73.56,35.98 73.88,35.66 73.88,34.71 73.25,34.71 IC5.18 | v54.67,27.56 53.24,27.56 IC2.4 | v31.65,54.71 32.29,54.08 32.29,41.38 32.13,41.22 32.13,33.6 32.29,33.44 32.29,31.85 v31.97,31.53 | v93.25,29.47 94.84,27.88 94.84,24.23 97.69,24.23 IC1.4
  Bottom 0.152: v54.67,27.56 v68.96,27.56 | v31.65,54.71 30.54,54.71 X1.18 | v31.97,31.53 32.61,30.9 37.37,30.9 37.69,31.22 54.04,31.22 54.36,30.9 v68.96,30.9 70.07,29.79 92.93,29.79 v93.25,29.47
IO4_2  (via drill 0.38)
  Top 0.152: v71.34,32.17 71.98,32.8 71.98,35.18 73.09,35.18 IC5.19 | v54.67,31.53 53.24,31.53 IC2.7 | v34.35,53.28 34.04,52.96 34.04,33.76 34.83,32.96 v34.83,31.53 | v95.47,29.47 95.47,25.98 98.81,25.98 99.12,26.29 99.12,27.88 97.85,27.88 IC1.7
  Bottom 0.152: v34.35,53.28 32.13,53.28 31.18,54.23 30.54,54.23 X1.19 | v34.83,31.53 v54.67,31.53 70.71,31.53 v71.34,32.17 72.61,30.9 74.83,30.9 74.99,31.06 82.61,31.06 83.57,30.1 94.84,30.1 v95.47,29.47
IO4_3  (via drill 0.38)
  Top 0.152: v56.9,34.71 56.9,35.18 65.31,35.18 IC5.20 65.47,35.34 67.53,35.34 67.85,35.03 67.85,28.68 v68.33,28.2 | IC2.8 53.24,32.8 53.56,32.8 v55.47,34.71 55.47,35.98 51.34,35.98 v45.94,30.58 | v29.27,53.76 28,52.49 v28,31.53 | v99.44,29.15 97.85,29.15 IC1.8
  Bottom 0.152: v55.47,34.71 v56.9,34.71 | v29.27,53.76 30.38,53.76 X1.20 | v28,31.53 28.8,30.74 32.29,30.74 32.45,30.58 37.53,30.58 37.69,30.74 45.78,30.74 v45.94,30.58 | v99.44,29.15 98.49,28.2 v68.33,28.2
IO4_4  (via drill 0.38)
  Top 0.152: v66.58,33.12 66.58,34.55 65.47,34.55 IC5.21 | v44.67,32.8 43.08,32.8 IC2.13 | v33.08,51.85 33.4,51.54 33.4,32.96 v33.56,32.8 | v84.52,32.49 84.52,29.31 87.69,29.31 IC1.13
  Bottom 0.152: v33.08,51.85 31.65,53.28 30.54,53.28 X1.21 | v33.56,32.8 v44.67,32.8 55.63,32.8 55.94,32.49 65.94,32.49 v66.58,33.12 66.74,33.28 83.72,33.28 v84.52,32.49
IO4_5  (via drill 0.38)
  Top 0.152: v57.05,29.79 57.05,34.07 65.31,34.07 IC5.22 | v31.97,30.1 31.02,31.06 31.02,51.69 v31.65,52.33
  Bottom 0.152: v57.05,29.79 56.74,29.47 32.61,29.47 v31.97,30.1 | v31.65,52.33 31.18,52.81 30.54,52.81 X1.22
IO4_6  (via drill 0.38)
  Top 0.152: v58.17,29.79 58.17,33.76 59.12,33.76 59.44,33.44 65.31,33.44 IC5.23 | v27.69,30.26 27.37,30.58 v27.37,49.95
  Bottom 0.152: v58.17,29.79 57.53,29.15 28.8,29.15 v27.69,30.26 | v27.37,49.95 29.75,52.33 30.38,52.33 X1.23
IO4_7  (via drill 0.38)
  Top 0.152: v58.8,33.12 58.8,32.8 65.31,32.8 IC5.24 | v31.65,51.38 v31.65,33.12
  Bottom 0.152: v58.8,33.12 58.48,33.44 31.97,33.44 v31.65,33.12 | v31.65,51.38 31.34,51.69 30.54,51.69 X1.24
LD_/C  (via drill 0.38)
  Top 0.152: IC5.29 61.34,29.47 61.34,25.66 v55.47,19.79 | v37.37,19.63 37.05,19.31 37.05,18.2 36.89,18.04 31.18,18.04 31.18,25.34 30.38,26.14 30.38,55.98 32.45,58.04 v32.45,59.16
  Bottom 0.152: 32.45,59.31 30.54,59.31 X1.9 | 32.45,59.31 35.94,59.31 35.94,65.35 34.83,66.46 20.07,66.46 18.64,65.03 R47.1 | v55.47,19.79 55.31,19.63 v37.37,19.63 | 32.45,59.31 v32.45,59.16
LEDK1  (via drill 0.38)
  Top 0.152: v22.61,51.69 26.1,48.2 v26.1,46.46
  Bottom 0.152: v22.61,51.69 22.76,51.69 22.76,53.6 R37.2 | v26.1,46.46 27.21,45.34 30.38,45.34 X1.37
LEDK2  (via drill 0.38)
  Top 0.152: v12.76,41.85 R38.2
  Bottom 0.152: v12.76,41.85 16.73,41.85 19.91,45.03 29.59,45.03 29.75,44.87 30.38,44.87 X1.38
LEDK3
  Bottom 0.152: R39.2 24.35,44.23 30.38,44.23 X1.39
LEDK4
  Bottom 0.152: R40.2 24.35,41.85 26.26,43.76 30.38,43.76 X1.40
LHVTRIG  (via drill 0.38)
  Top 0.152: v108.01,31.22 112.46,31.22 R13.1 | v63.25,23.6 63.72,24.07 63.72,28.2 64.2,28.68 65.31,28.68 IC5.30
  Bottom 0.152: v108.01,31.22 100.39,23.6 v63.25,23.6
LLED  (via drill 0.38)
  Top 0.152: R42.1 16.73,41.53 16.89,41.69 16.89,44.07 R44.1 19.59,44.07 20.38,43.28 20.38,41.53 R43.1 22.76,41.53 22.76,39.63 R41.1 v22.92,28.83 | v59.12,29.79 59.12,30.74 65.31,30.74 IC5.27
  Bottom 0.152: v59.12,29.79 58.17,28.83 v22.92,28.83
LRD  (via drill 0.38)
  Top 0.152: IC5.10 69.6,29.47 69.6,14.07 68.64,13.12 68.64,11.05 63.25,5.66 44.67,5.66 44.67,6.13 33.08,17.72 28.48,17.72 28.48,31.06 29.91,32.49 29.91,57.73 v29.27,58.36
  Bottom 0.152: R50.1 18.64,59.31 20.22,60.9 21.81,60.9 22.61,61.7 25.94,61.7 v29.27,58.36 30.38,58.36 X1.11
LRESET  (via drill 0.38)
  Top 0.152: v67.21,28.52 67.21,31.37 65.47,31.37 IC5.26 | v38,30.1 35.15,32.96 35.15,40.9 34.35,41.69 34.35,52.33 35.31,53.28 35.31,60.11 v34.99,60.43
  Bottom 0.152: v67.21,28.52 65.31,30.42 46.74,30.42 46.26,29.95 38.16,29.95 v38,30.1 | v34.99,60.43 34.83,60.27 30.54,60.27 X1.7
LTS+
  Top 0.152: 100.55,3.43 98.96,1.85 89.6,1.85 X3.1 | 100.55,3.43 101.5,4.39 101.5,10.42 99.28,12.64 R12.2 | 100.55,3.43 120.87,3.43 121.67,4.23 121.67,9.47 F1.P$4
LTS-
  Top 0.152: R12.1 99.12,13.91 94.04,8.83 94.04,5.18 X3.2
  Bottom 0.152: F1.P$3 121.67,19.79 121.67,22.48 103.41,22.48 95,14.07 95,8.36 94.04,7.4 94.04,5.18 X3.2
LVSEL  (via drill 0.38)
  Top 0.152: v74.36,31.85 74.36,32.01 73.25,32.01 IC5.14 | v86.11,31.85 87.69,31.85 IC1.11
  Bottom 0.152: v86.11,31.85 v74.36,31.85
LWR  (via drill 0.38)
  Top 0.152: v21.18,61.54 23.08,61.54 23.24,61.7 27.84,61.7 v27.84,60.74 27.84,56.46 26.73,55.35 26.73,24.71 v27.84,23.6 | v70.23,27.56 70.23,28.68 73.09,28.68 IC5.9 | v55.63,23.6 v58.32,26.29
  Bottom 0.152: v21.18,61.54 18.95,61.54 18.64,61.22 R49.1 | v27.84,60.74 29.75,58.84 30.38,58.84 X1.10 | v70.23,27.56 68.96,26.29 v58.32,26.29 | v27.84,23.6 v55.63,23.6
N$1
  Top 0.152: R1.1 95.79,49.15 93.25,46.61 93.25,30.42 92.61,29.79 92.61,25.98 96.9,21.69 97.69,21.69 IC1.2
N$2  (via drill 0.38)
  Top 0.152: v101.35,28.04 101.35,34.23 102.3,35.18 R2.1 | v99.76,26.45 98.81,25.5 97.85,25.5 IC1.5
  Bottom 0.152: v99.76,26.45 v101.35,28.04
N$3
  Top 0.152: R3.1 95.95,35.18 96.11,35.03 96.11,27.88 97.22,26.77 97.69,26.77 IC1.6
N$4
  Top 0.152: R4.1 95.95,37.72 96.58,37.09 96.58,32.33 96.42,32.17 96.42,31.37 97.22,30.58 97.69,30.58 IC1.9
N$5  (via drill 0.38)
  Top 0.152: R5.1 110.55,40.26 110.55,39.95 v104.84,34.23 | v86.11,30.9 87.69,30.9 87.69,30.58 IC1.12
  Bottom 0.152: v104.84,34.23 101.5,30.9 v86.11,30.9
N$6
  Top 0.152: 106.9,60.58 108.01,59.47 L3.2 | 106.9,60.58 106.58,60.9 106.58,65.66 97.22,65.66 96.9,65.35 96.9,60.11 95.95,59.16 T8.1 | 106.9,60.58 SG1.-
N$7  (via drill 0.38)
  Top 0.152: v108.97,42.65 108.97,45.03 T4.3 | v97.69,39.47 97.38,39.15 97.38,37.72 R4.2
  Bottom 0.152: v108.97,42.65 105.79,39.47 v97.69,39.47
N$8
  Top 0.152: T5.3 114.05,38.84 113.89,38.99 113.89,40.26 R5.2
N$9
  Top 0.152: F1.P$1 102.77,19.79 102.77,24.71 106.9,28.83 D2.A 107.06,28.83 107.06,28.04 118.49,28.04 121.82,31.37 H1.4
N$10  (via drill 0.38)
  Top 0.152: v96.58,53.28 96.58,52.96 95.63,52.96 T1.1 | v100.08,53.28 100.87,53.28 100.87,52.96 R7.1
  Bottom 0.152: v100.08,53.28 v96.58,53.28
N$11  (via drill 0.38)
  Top 0.152: v100.71,42.8 100.71,42.65 101.5,42.65 T2.1 | v121.03,48.84 121.19,49 121.19,49.79 R8.1
  Bottom 0.152: v100.71,42.8 101.19,43.28 119.76,43.28 121.03,44.55 v121.03,48.84
N$12
  Top 0.152: T3.1 121.98,53.12 121.35,52.49 121.35,51.69 R9.1
N$13
  Top 0.152: T1.3 97.54,51.85 97.38,51.69 97.38,49.15 R1.2
N$14
  Top 0.152: T2.3 100.71,40.42 101.35,39.79 101.35,35.5 101.03,35.18 R2.2
N$15  (via drill 0.38)
  Top 0.152: v123.25,46.3 123.25,55.03 123.09,55.19 T3.3 | v98.17,35.98 97.38,35.18 R3.2
  Bottom 0.152: v123.25,46.3 116.27,39.31 106.11,39.31 105.95,39.15 101.35,39.15 v98.17,35.98
N$16
  Top 0.152: T4.1 108.01,43.12 106.43,43.12 106.43,50.11 118.33,62.01 121.67,62.01 121.67,54.08 120.4,52.81 120.4,48.04 121.19,47.25 R10.1
N$17  (via drill 0.38)
  Top 0.152: R7.2 102.46,52.96 102.46,50.42 C1.2 v104.04,50.42 | 122.62,49.79 v122.62,50.74 122.62,51.69 R9.2 | 122.62,47.25 122.62,44.71 | 122.62,47.25 122.62,49.79 | 122.62,49.79 R8.2 | 122.62,47.25 R10.2 | 122.62,44.71 122.62,42.33 121.98,41.69 IC7.7 | 122.62,44.71 R11.2
  Bottom 0.152: v104.04,50.42 104.36,50.74 v122.62,50.74
N$18
  Top 0.152: 121.35,44.71 121.35,37.09 120.71,36.45 | 120.71,36.45 C6.1 | 120.71,36.45 IC7.1 | 107.54,30.58 104.2,33.91 104.2,47.09 102.93,48.36 | 107.54,30.58 107.7,30.42 107.7,28.99 109.44,28.99 D2.C | 102.77,48.52 100.87,50.42 C1.1 | 102.77,48.52 102.93,48.36 | 102.77,48.52 100.87,46.61 C5.1 | 107.54,30.58 101.66,24.71 101.66,18.99 101.82,18.83 101.82,10.42 102.62,9.63 F1.P$2 | 121.35,44.71 121.98,45.34 121.98,52.17 122.3,52.49 122.78,52.49 122.78,54.23 121.98,55.03 121.98,62.17 121.82,62.33 113.73,62.33 113.73,59.16 102.93,48.36 | 121.35,44.71 R11.1
N$19
  Top 0.152: 6.41,31.37 H2.4 5.94,31.37 | 6.41,31.37 13.08,31.37 15.14,29.31 D1.A | 6.41,31.37 F2.P$1
N$20  (via drill 0.38)
  Top 0.152: v8.48,42.65 8.48,45.5 R15.1 | v54.67,25.34 53.24,25.34 53.24,25.18 IC2.2
  Bottom 0.152: v8.48,42.65 2.92,37.09 2.92,25.66 54.36,25.66 v54.67,25.34
N$21
  Top 0.152: R13.2 112.46,32.8 114.52,32.8 114.52,33.6 H1.1
N$22
  Top 0.152: T8.3 95,57.09 95.15,57.25 95.15,59.79 95.95,60.58 R14.2
N$24  (via drill 0.38)
  Top 0.152: v17.37,30.1 17.37,38.04 14.51,40.9 14.51,48.84 12.92,50.42 R16.1 | v55.31,25.98 54.36,25.98 54.2,25.82 51.82,25.82 51.82,28.2 52.45,28.83 53.09,28.83 IC2.5
  Bottom 0.152: v17.37,30.1 21.49,25.98 v55.31,25.98
N$25  (via drill 0.38)
  Top 0.152: v9.59,35.82 9.59,46.3 8.32,46.3 7.52,47.09 7.52,48.2 8,48.68 8,49.47 8.32,49.79 R17.1 | v55.31,32.17 55.31,31.22 54.36,30.26 53.24,30.26 IC2.6
  Bottom 0.152: v9.59,35.82 17.37,35.82 17.68,35.5 28.32,35.5 31.65,32.17 v55.31,32.17
N$26  (via drill 0.38)
  Top 0.152: v55.31,28.2 54.36,29.15 54.36,29.47 54.2,29.63 51.82,29.63 51.82,33.28 52.45,33.91 53.09,33.91 IC2.9
  Bottom 0.152: v55.31,28.2 54.99,28.52 39.27,28.52 38.96,28.2 19.75,28.2 19.75,30.74 17.05,33.44 3.24,33.44 3.24,36.93 4.83,38.52 5.46,38.52 13.24,46.3 18.32,46.3 18.32,57.57 R18.1
N$27  (via drill 0.38)
  Top 0.152: v26.1,27.25 23.56,29.79 23.56,49.63 20.54,52.65 20.54,57.41 12.92,65.03 R19.1 | v39.59,27.88 41.66,29.95 41.66,33.12 42.45,33.91 42.93,33.91 IC2.12
  Bottom 0.152: v26.1,27.25 26.42,27.56 37.53,27.56 37.85,27.88 v39.59,27.88
N$28  (via drill 0.38)
  Top 0.152: v17.05,45.34 15.78,44.07 R44.2
  Bottom 0.152: v17.05,45.34 23.72,45.34 24.51,46.14 T13.3
N$29  (via drill 0.38)
  Top 0.152: v11.02,45.03 T6.3 | v7.84,44.71 7.21,45.34 7.21,45.5 R15.2
  Bottom 0.152: v11.02,45.03 10.7,44.71 v7.84,44.71
N$30
  Top 0.152: T7.3 13.24,53.92 12.92,53.6 12.92,51.38 12.76,51.22 11.49,51.22 11.49,50.42 R16.2
N$31
  Top 0.152: T9.3 8.32,55.98 6.41,55.98 6.41,53.76 7.68,52.49 7.68,50.9 7.05,50.27 7.05,49.95 R17.2
N$32  (via drill 0.38)
  Top 0.152: v16.1,57.73 13.24,57.73 T10.3
  Bottom 0.152: v16.1,57.73 17.05,57.73 R18.2
N$33
  Top 0.152: T11.3 13.08,62.81 12.92,62.65 12.92,60.43 12.6,60.11 11.49,60.11 11.49,62.01 11.81,62.33 11.81,64.71 11.49,65.03 R19.2
N$35
  Top 0.152: T6.1 11.97,47.88 10.38,47.88 10.38,38.99 R22.1
N$36
  Top 0.152: T7.1 12.13,51.85 8.95,51.85 8.95,48.36 8.32,47.73 R23.1
N$37
  Top 0.152: T9.1 6.41,56.93 6.1,56.62 6.1,52.81 6.89,52.01 R24.1
N$38
  Top 0.152: T10.1 12.13,55.66 11.97,55.5 11.97,53.44 11.81,53.28 8.48,53.28 8.48,54.23 R25.1
N$39
  Top 0.152: R26.2 14.03,38.99 13.72,38.68 C2.2 13.56,36.45 11.65,34.55 8.95,34.55 8.95,35.03 | R25.2 7.05,54.23 8,53.28 8,52.33 8.32,52.01 R24.2 8.32,51.85 8,51.54 8,50.74 7.68,50.42 7.68,48.84 7.05,48.2 7.05,47.73 R23.2 6.89,47.57 6.57,47.25 6.57,45.03 7.68,43.92 7.68,40.11 8.79,38.99 R22.2 8.95,35.03 | 8.95,35.03 6.57,35.03 6.41,35.18 6.41,37.57 5.14,38.84 5.14,40.9 4.51,41.53 IC8.7
N$40  (via drill 0.38)
  Top 0.152: C8.1 30.23,19.47 29.91,19.79 29.91,22.8 C7.1 29.75,22.96 29.11,23.6 v29.11,29.79 | R26.1 12.6,38.99 11.97,38.36 11.97,36.45 C2.1 v10.54,35.18 | v13.87,24.71 13.87,25.34 17.68,29.15 D1.C | 2.44,34.87 2.44,13.75 F2.P$2 | 2.44,34.87 2.44,35.5 3.24,36.3 IC8.1 | 2.44,34.87 v3.87,34.87
  Bottom 0.152: v13.87,24.71 12.92,23.75 8,23.75 5.46,21.21 5.46,9.78 F2.P$2 | v3.87,34.87 10.22,34.87 v10.54,35.18 19.75,35.18 24.03,30.9 28,30.9 v29.11,29.79
N$41
  Bottom 0.152: R37.1 23.72,53.6 23.72,52.17 T12.1
N$42  (via drill 0.38)
  Top 0.152: v70.23,15.18 70.23,19.94 71.5,21.21 R21.2 | v14.83,24.55 14.35,24.07 13.24,24.07 13.24,28.99 H2.1
  Bottom 0.152: v70.23,15.18 69.91,15.5 50.39,15.5 47.85,18.04 44.35,18.04 40.23,13.91 34.04,13.91 23.4,24.55 v14.83,24.55
N$43
  Top 0.152: T15.1 11.97,42.8 11.49,43.28 11.49,44.07 R38.1
N$44  (via drill 0.38)
  Top 0.152: v20.22,44.39 20.22,45.34 T14.1
  Bottom 0.152: v20.22,44.39 22.92,44.39 R39.1
N$45
  Top 0.152: IC7.4 124.52,35.03 119.44,35.03 118.33,33.91 118.33,28.36 113.73,28.36 113.57,28.52 113.57,32.01 111.98,32.01 111.51,32.49 111.51,39.47 112.62,39.47 112.78,39.31 112.78,37.09 113.09,36.77 T5.1
N$46
  Bottom 0.152: T13.1 23.56,48.2 22.29,46.93 22.13,46.93 21.18,45.98 14.51,45.98 10.54,42.01 10.54,41.06 22.29,41.06 22.92,41.69 R40.1
N$47
  Top 0.152: IC8.4 7.05,37.41 6.41,38.04 6.41,42.8 5.62,43.6 5.62,57.41 5.78,57.57 5.78,65.98 11.81,65.98 12.13,65.66 12.13,60.9 T11.1
N$48
  Top 0.152: T14.3 19.11,43.28 19.11,41.53 R43.2
N$49  (via drill 0.38)
  Top 0.152: v24.51,48.04 24.35,47.88 24.35,39.63 R41.2
  Bottom 0.152: v24.51,48.04 24.51,49.95 T12.3
N$50  (via drill 0.38)
  Top 0.152: v11.18,41.69 11.18,40.9 11.02,40.74 T15.3 | v15.14,42.49 15.3,42.33 15.3,41.53 R42.2
  Bottom 0.152: v11.18,41.69 11.97,42.49 v15.14,42.49
RHVTRIG
  Top 0.152: R21.1 72.77,21.37 72.29,21.85 72.29,24.55 72.61,24.87 73.09,24.87 IC5.3
RTS+
  Top 0.152: F2.P$4 25.46,12.64 29.11,12.64 R27.2 29.27,12.64 34.04,7.88 34.04,7.09 39.12,2.01 X5.1
RTS-
  Top 0.152: F2.P$3 25.46,17.72 29.11,14.07 R27.1 29.27,13.91 35.15,13.91 43.72,5.34 X5.2
RVSEL  (via drill 0.38)
  Top 0.152: v67.21,34.71 67.21,32.17 65.47,32.17 IC5.25 | v44.67,35.34 43.08,35.34 IC2.11
  Bottom 0.152: v67.21,34.71 66.58,35.34 v44.67,35.34
SCL  (via drill 0.38)
  Top 0.152: 75.47,12.17 77.37,10.26 77.37,8.83 X2.2 | 75.47,12.17 74.83,12.8 74.83,27.72 73.88,28.68 73.88,31.37 73.25,31.37 IC5.13 | v49.59,6.61 49.59,8.51 49.43,8.67 X4.2 | 75.47,12.17 v68.96,5.66
  Bottom 0.152: v49.59,6.61 50.55,5.66 v68.96,5.66
SDA  (via drill 0.38)
  Top 0.152: v71.66,30.9 73.09,30.9 IC5.12 | v82.3,30.42 82.3,24.87 78.33,20.9 v78.33,18.99 78.33,8.83 X2.3 | v50.55,18.99 50.55,9.15 50.23,8.83 X4.3
  Bottom 0.152: v71.66,30.9 72.14,30.42 v82.3,30.42 | v78.33,18.99 v50.55,18.99
SPKR  (via drill 0.38)
  Top 0.152: v87.53,35.18 87.53,34.39 92.14,34.39 92.93,35.18 92.93,59 94.52,60.58 R14.1 | v71.34,35.34 70.71,34.71 70.71,30.9 71.34,30.26 73.09,30.26 IC5.11
  Bottom 0.152: v87.53,35.18 87.38,35.34 v71.34,35.34
TCK  (via drill 0.38)
  Top 0.152: 67.06,25.5 65.47,25.5 IC5.35 | 67.06,25.5 67.06,12.64 SV1.3 | 67.06,25.5 v67.06,25.66
  Bottom 0.152: v67.06,25.66 68.8,25.66 69.28,26.14 97.38,26.14 104.04,32.8 105.63,32.8 105.63,37.57 S5.4
TDI
  Top 0.152: IC5.37 65.31,24.23 64.67,24.23 64.67,14.71 62.45,12.48 62.45,12.32 SV1.5
  Bottom 0.152: SV1.5 60.55,14.07 49.43,14.07 46.58,16.93 S7.4
TDO
  Top 0.152: IC5.38 65.31,23.6 64.99,23.28 64.99,14.55 63.56,13.12 63.56,11.05 62.93,10.42 59.91,10.42 59.91,12.17 SV1.6
TEST
  Top 0.152: IC5.1 73.25,23.6 73.56,23.28 73.56,13.28 72.61,12.32 SV1.1
TMS  (via drill 0.38)
  Top 0.152: IC5.36 65.47,24.87 66.26,24.87 66.26,13.59 64.99,12.32 SV1.4 | v18,36.77 22.29,32.49 22.29,27.88 v27.84,22.33
  Bottom 0.152: v18,36.77 17.68,36.77 16.26,38.2 S6.4 | v27.84,22.33 31.81,18.36 62.45,18.36 64.99,15.82 70.71,15.82 71.02,15.5 71.02,14.07 66.74,14.07 64.99,12.32 SV1.4
VBAT  (via drill 0.38)
  Top 0.152: 95.79,41.53 95.63,41.69 95.63,44.39 96.27,45.03 97.54,45.03 100.71,41.85 102.3,41.85 102.3,44.07 R46.2 | v66.58,30.1 65.47,30.1 IC5.28 | v94.84,28.83 94.36,29.31 94.36,40.11 95.79,41.53 | 95.79,41.53 R45.1
  Bottom 0.152: v66.58,30.1 67.85,28.83 v94.84,28.83
VCC  (via drill 0.38)
  Top 0.305: v47.85,8.83 48.48,8.83 X4.1 | v75.95,9.47 76.58,8.83 X2.1 | 108.01,62.01 L3.1 108.01,61.85 | 108.01,62.01 108.01,66.14 97.06,66.14 95.31,64.39 C10.1 | IC3.3 117.38,43.76 118.81,45.19 118.81,60.58 SG1.+ | v111.51,62.01 108.01,62.01
  Bottom 0.305: v47.85,8.83 48.48,9.47 v75.95,9.47 80.39,13.91 94.2,13.91 109.6,29.31 111.19,29.31 124.36,42.49 124.36,60.58 SG1.+ 118.81,60.58 117.38,62.01 v111.51,62.01
XIN  (via drill 0.38)
  Top 0.152: v71.98,26.77 73.09,26.77 IC5.6 | v78.17,27.56 Q3.2 78.17,30.42 C12.1
  Bottom 0.152: v71.98,26.77 77.37,26.77 v78.17,27.56
XOUT  (via drill 0.38)
  Top 0.152: v74.2,27.41 74.2,26.29 73.25,26.29 IC5.5 | v77.06,27.41 77.69,26.77 78.17,26.77 Q3.1 78.17,26.61 C11.1
  Bottom 0.152: v77.06,27.41 v74.2,27.41